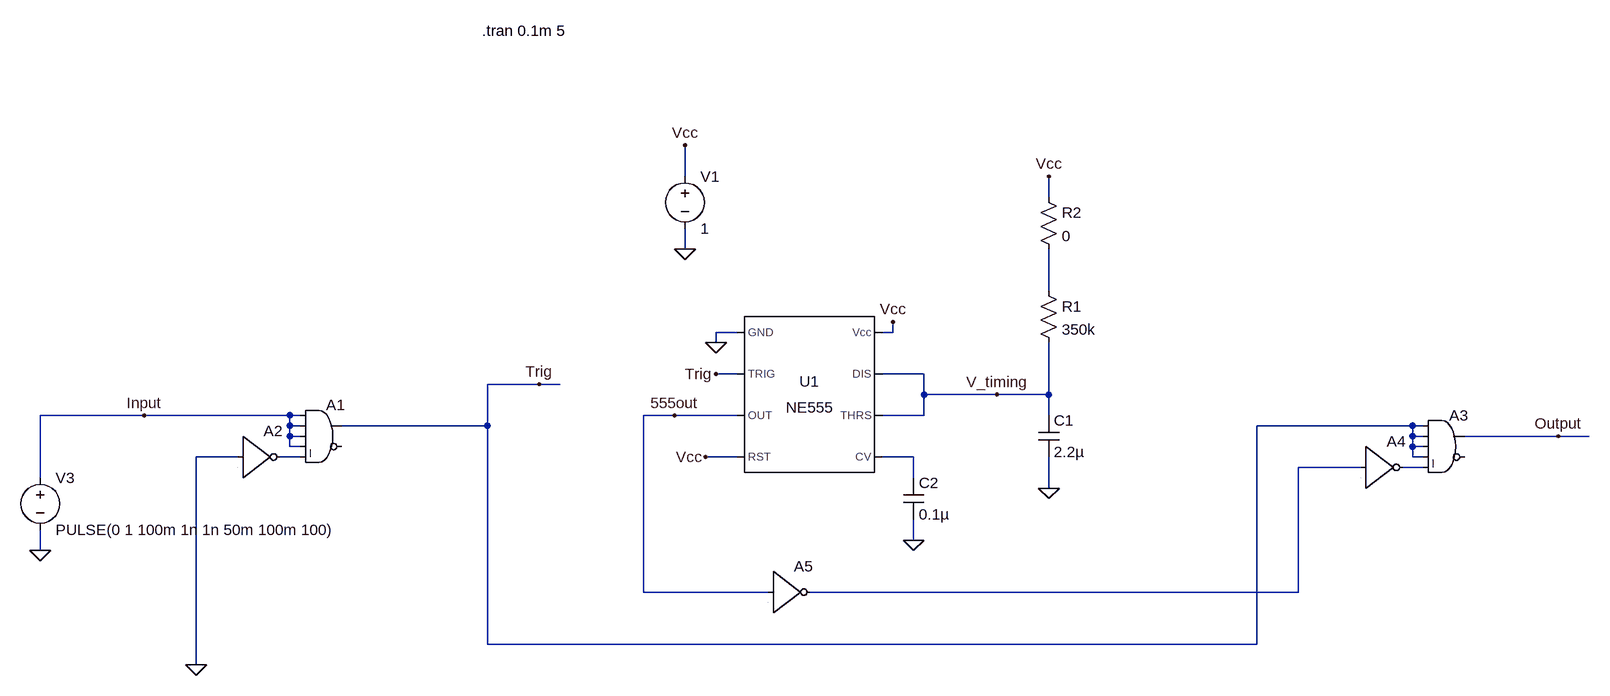
[diagram p0: schematic clock_divider2.asc]
clock_divider2.asc, the LTspice schematic file:
Version 4
SHEET 1 1400 836
WIRE 0 -176 0 -224
WIRE 560 -144 560 -176
WIRE 0 -64 0 -96
WIRE 560 0 560 -64
WIRE 80 64 48 64
WIRE 320 64 320 48
WIRE 320 64 304 64
WIRE 48 80 48 64
WIRE 80 128 48 128
WIRE 368 128 304 128
WIRE -224 144 -304 144
WIRE -192 144 -224 144
WIRE 368 160 368 128
WIRE 480 160 368 160
WIRE 560 160 560 80
WIRE 560 160 480 160
WIRE -832 192 -992 192
WIRE -608 192 -832 192
WIRE -592 192 -608 192
WIRE -16 192 -64 192
WIRE 80 192 -16 192
WIRE 368 192 368 160
WIRE 368 192 304 192
WIRE 560 192 560 160
WIRE -608 208 -608 192
WIRE -592 208 -608 208
WIRE -304 208 -304 144
WIRE -304 208 -528 208
WIRE 1120 208 880 208
WIRE 1136 208 1120 208
WIRE -608 224 -608 208
WIRE -592 224 -608 224
WIRE 1120 224 1120 208
WIRE 1136 224 1120 224
WIRE 1344 224 1200 224
WIRE 1392 224 1344 224
WIRE -608 240 -608 224
WIRE -592 240 -608 240
WIRE 1120 240 1120 224
WIRE 1136 240 1120 240
WIRE -688 256 -752 256
WIRE -592 256 -624 256
WIRE 80 256 32 256
WIRE 352 256 304 256
WIRE 1120 256 1120 240
WIRE 1136 256 1120 256
WIRE 1040 272 944 272
WIRE 1136 272 1104 272
WIRE -992 288 -992 192
WIRE 352 288 352 256
WIRE 560 304 560 256
WIRE 352 384 352 352
WIRE -992 400 -992 368
WIRE -64 464 -64 192
WIRE 128 464 -64 464
WIRE 944 464 944 272
WIRE 944 464 192 464
WIRE -304 544 -304 208
WIRE 880 544 880 208
WIRE 880 544 -304 544
WIRE -752 576 -752 256
FLAG 48 80 0
FLAG 560 304 0
FLAG 560 -176 Vcc
FLAG 0 -64 0
FLAG 0 -224 Vcc
FLAG 320 48 Vcc
FLAG 352 384 0
FLAG 32 256 Vcc
FLAG 48 128 Trig
FLAG -832 192 Input
FLAG -992 400 0
FLAG -224 144 Trig
FLAG 1344 224 Output
FLAG -752 576 0
FLAG 480 160 V_timing
FLAG -16 192 555out
SYMBOL Misc\\NE555 192 160 R0
SYMATTR InstName U1
SYMBOL res 544 -16 R0
SYMATTR InstName R1
SYMATTR Value 350k
SYMBOL cap 544 192 R0
SYMATTR InstName C1
SYMATTR Value 2.2µ
SYMBOL voltage 0 -192 R0
WINDOW 123 0 0 Left 0
WINDOW 39 0 0 Left 0
SYMATTR InstName V1
SYMATTR Value 1
SYMBOL cap 336 288 R0
SYMATTR InstName C2
SYMATTR Value 0.1µ
SYMBOL Digital\\and -560 160 R0
SYMATTR InstName A1
SYMBOL Digital\\inv -688 192 R0
SYMATTR InstName A2
SYMBOL voltage -992 272 R0
WINDOW 123 0 0 Left 0
WINDOW 39 0 0 Left 0
SYMATTR InstName V3
SYMATTR Value PULSE(0 1 100m 1n 1n 50m 100m 100)
SYMBOL Digital\\and 1168 176 R0
SYMATTR InstName A3
SYMBOL Digital\\inv 1040 208 R0
SYMATTR InstName A4
SYMBOL res 544 -160 R0
SYMATTR InstName R2
SYMATTR Value 0
SYMBOL Digital\\inv 128 400 R0
SYMATTR InstName A5
TEXT -312 -400 Left 2 !.tran 0.1m 5

The netlist it stands for:
* clock_divider2.asc
XU1 0 Trig 555out Vcc N003 V_timing V_timing Vcc NE555  ; pins GND TRIG OUT RST CV THRS DIS Vcc
R1 N001 V_timing 350k
C1 V_timing 0 2.2µ
V1 Vcc 0 1
C2 N003 0 0.1µ
A1 Input Input Input Input N002 0 Trig 0 AND
A2 0 0 0 0 0 N002 0 0 BUF
V3 Input 0 PULSE(0 1 100m 1n 1n 50m 100m 100)
A3 Trig Trig Trig Trig N005 0 Output 0 AND
A4 N004 0 0 0 0 N005 0 0 BUF
R2 Vcc N001 0
A5 555out 0 0 0 0 N004 0 0 BUF
.tran 0.1m 5
.lib NE555.sub
.backanno
.end